# EAGLE board pic32mk (EAGLE 9.6.2), part 1 of 2
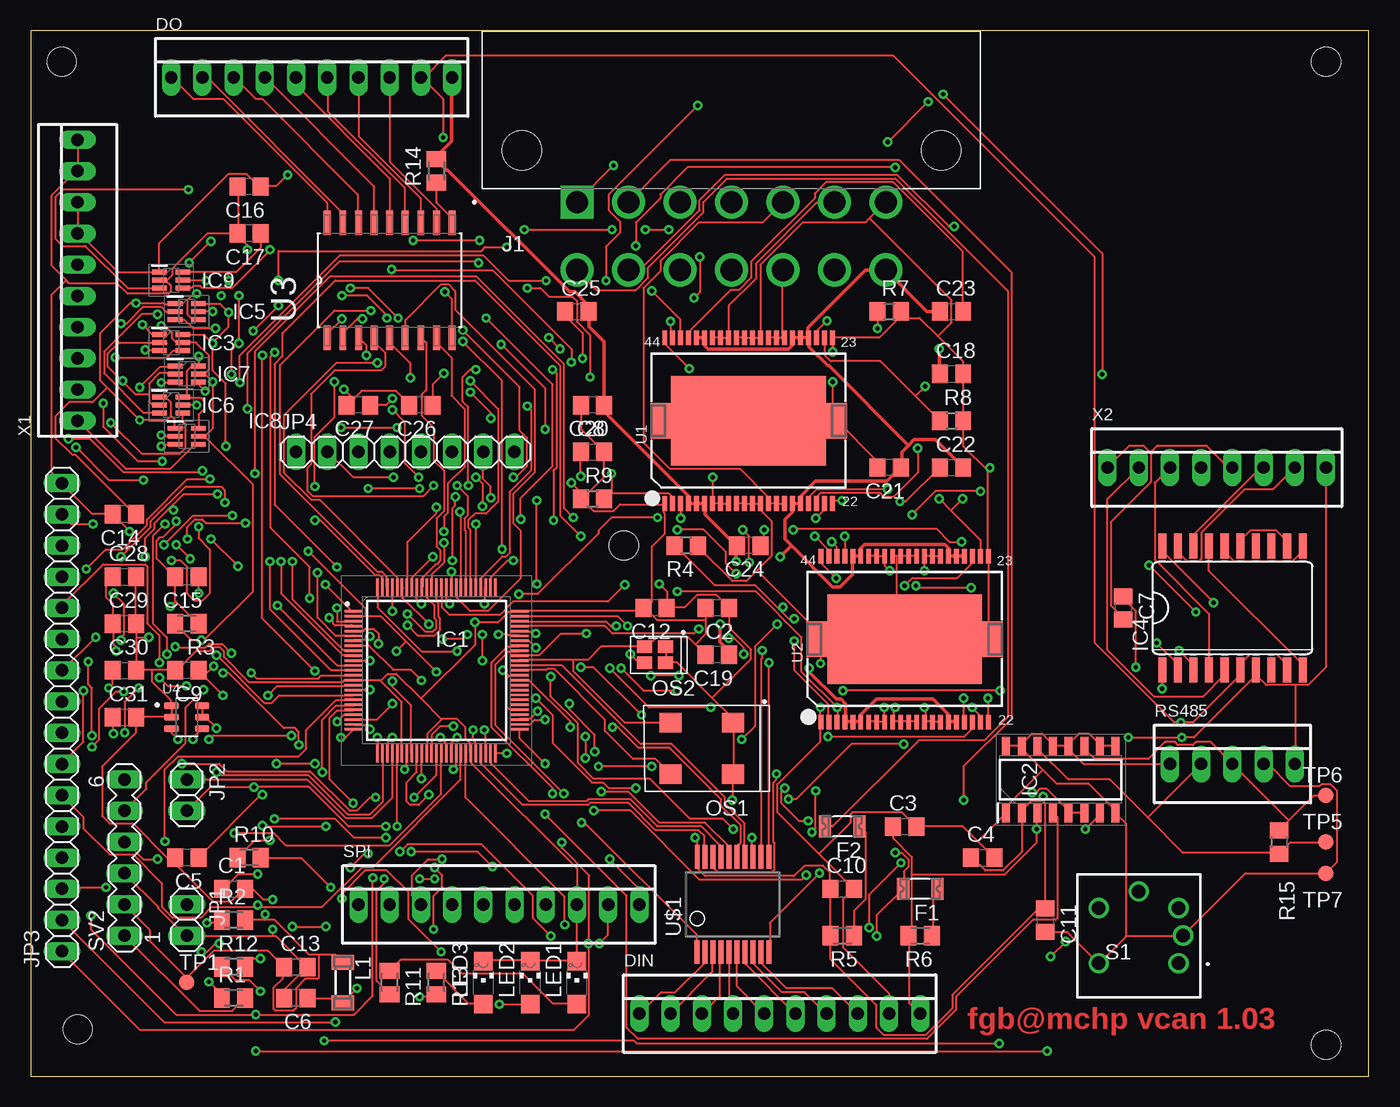
[diagram p1: board, top side]
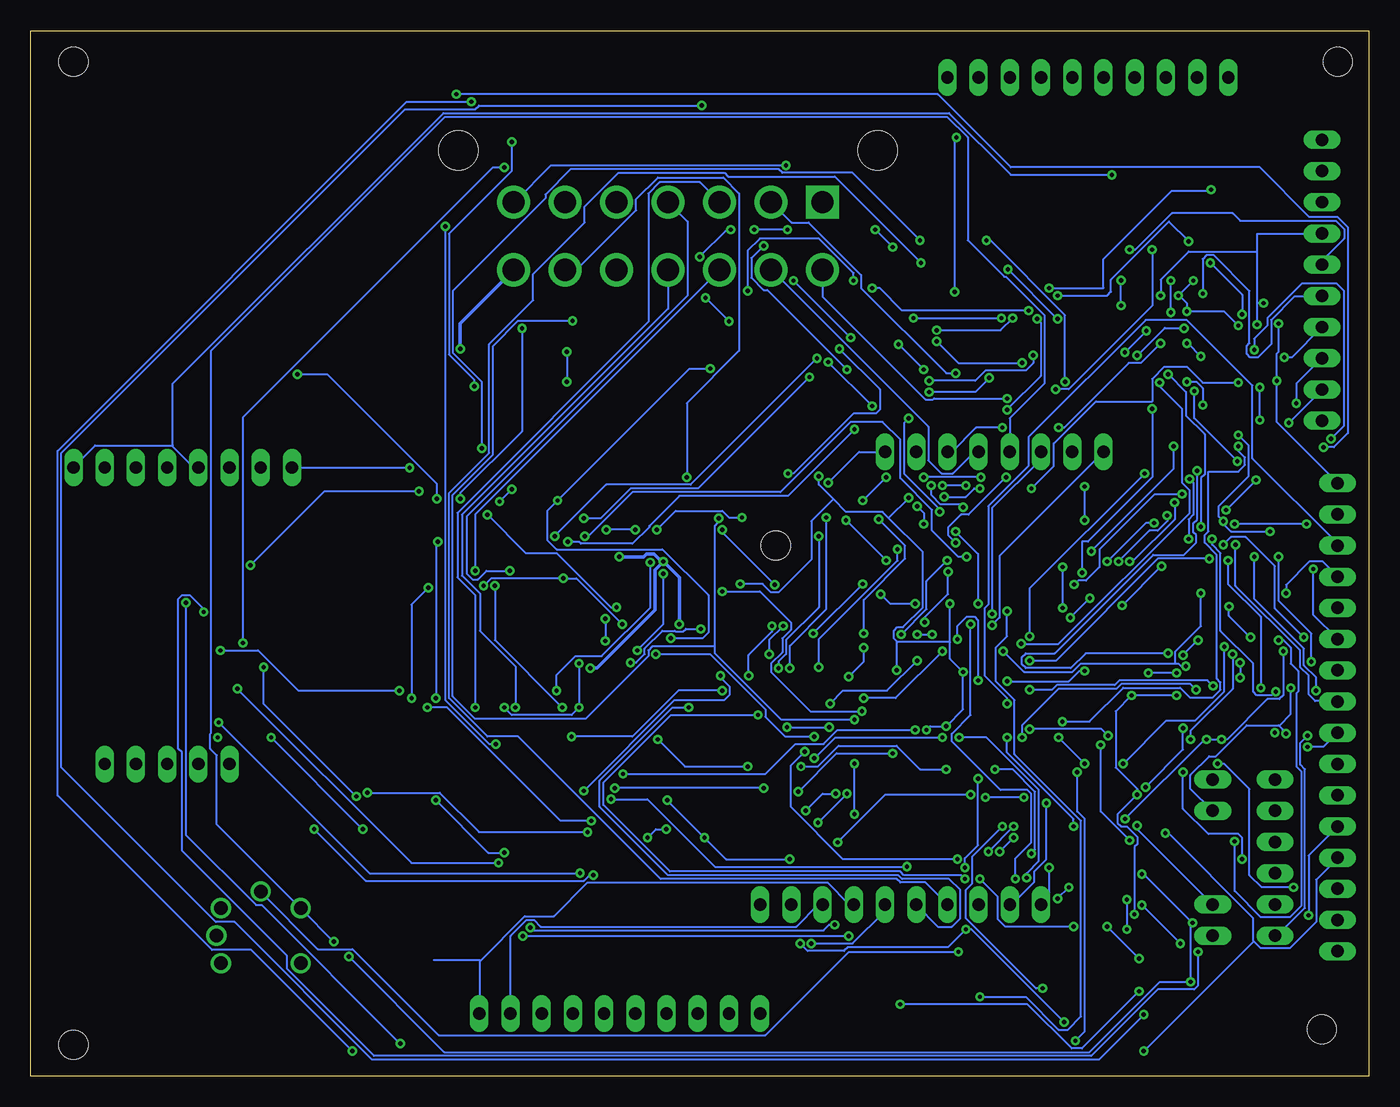
[diagram p2: board, bottom side, seen from below]

Size 108.89 x 85.08 mm. Coordinates in mm from the lower left corner, seen from the top.
Outline: 0,0 108.89,0 108.89,85.08 0,85.08 0,0
Copper layers (1*16): Top 0.035mm / dielectric 1.5mm / Bottom 0.035mm
Design rules "default *": minimum track width 6mil, minimum drill 0.35mm, track to track 6mil, track to pad 6mil, pad to pad 6mil, via to via 6mil, smd to smd 0mil, copper to edge 40mil, drill to drill 6mil, minimum pad ring 10mil, minimum via ring 8mil, stop-mask expansion 4mil, vias tented up to drill 0mil, thermal gap 10mil
Net classes: 0 default: width 0.127 mm, drill 0.127 mm, clearance 0.127 mm; 1 icurrent: width 0.178 mm; 2 mcurrent: width 0.305 mm
Holes 2.35 mm at 2.54,82.55 105.41,82.55 105.41,2.54 3.81,3.81 48.26,43.18

## Footprints (pad centres in the part's own frame; a part is rotated, then mirrored left to right if it is on the bottom)
C0805 = smd 1.3 x 1.5: 1 -0.95,0; 2 0.95,0
22-23-2101 = drill 1 long: 1 -11.43,0; 2 -8.89,0; 3 -6.35,0; 4 -3.81,0; 5 -1.27,0; 6 1.27,0; 7 3.81,0; 8 6.35,0; 9 8.89,0; 10 11.43,0
1206L = smd 1 x 1.8: 1 -1.4,0; 2 1.4,0
QFP40P1400X1400X120-100N = smd 1.475 x 0.2: 1 -6.738,4.8; 2 -6.738,4.4; 3 -6.738,4; 4 -6.738,3.6; 5 -6.738,3.2; 6 -6.738,2.8; 7 -6.738,2.4; 8 -6.738,2; 9 -6.738,1.6; 10 -6.738,1.2; 11 -6.738,0.8; 12 -6.738,0.4; 13 -6.738,0; 14 -6.738,-0.4; 15 -6.738,-0.8; 16 -6.738,-1.2; 17 -6.738,-1.6; 18 -6.738,-2; 19 -6.738,-2.4; 20 -6.738,-2.8; 21 -6.738,-3.2; 22 -6.738,-3.6; 23 -6.738,-4; 24 -6.738,-4.4; 25 -6.738,-4.8; 51 6.738,-4.8; 52 6.738,-4.4; 53 6.738,-4; 54 6.738,-3.6; 55 6.738,-3.2; 56 6.738,-2.8; 57 6.738,-2.4; 58 6.738,-2; 59 6.738,-1.6; 60 6.738,-1.2; 61 6.738,-0.8; 62 6.738,-0.4; 63 6.738,0; 64 6.738,0.4; 65 6.738,0.8; 66 6.738,1.2; 67 6.738,1.6; 68 6.738,2; 69 6.738,2.4; 70 6.738,2.8; 71 6.738,3.2; 72 6.738,3.6; 73 6.738,4; 74 6.738,4.4; 75 6.738,4.8 | smd 0.2 x 1.475: 26 -4.8,-6.738; 27 -4.4,-6.738; 28 -4,-6.738; 29 -3.6,-6.738; 30 -3.2,-6.738; 31 -2.8,-6.738; 32 -2.4,-6.738; 33 -2,-6.738; 34 -1.6,-6.738; 35 -1.2,-6.738; 36 -0.8,-6.738; 37 -0.4,-6.738; 38 0,-6.738; 39 0.4,-6.738; 40 0.8,-6.738; 41 1.2,-6.738; 42 1.6,-6.738; 43 2,-6.738; 44 2.4,-6.738; 45 2.8,-6.738; 46 3.2,-6.738; 47 3.6,-6.738; 48 4,-6.738; 49 4.4,-6.738; 50 4.8,-6.738; 76 4.8,6.738; 77 4.4,6.738; 78 4,6.738; 79 3.6,6.738; 80 3.2,6.738; 81 2.8,6.738; 82 2.4,6.738; 83 2,6.738; 84 1.6,6.738; 85 1.2,6.738; 86 0.8,6.738; 87 0.4,6.738; 88 0,6.738; 89 -0.4,6.738; 90 -0.8,6.738; 91 -1.2,6.738; 92 -1.6,6.738; 93 -2,6.738; 94 -2.4,6.738; 95 -2.8,6.738; 96 -3.2,6.738; 97 -3.6,6.738; 98 -4,6.738; 99 -4.4,6.738; 100 -4.8,6.738
SOIC127P600X175-16N = smd 1.525 x 0.65: 1 -2.712,4.445; 2 -2.712,3.175; 3 -2.712,1.905; 4 -2.712,0.635; 5 -2.712,-0.635; 6 -2.712,-1.905; 7 -2.712,-3.175; 8 -2.712,-4.445; 9 2.712,-4.445; 10 2.712,-3.175; 11 2.712,-1.905; 12 2.712,-0.635; 13 2.712,0.635; 14 2.712,1.905; 15 2.712,3.175; 16 2.712,4.445
SOT65P210X110-6N = smd 1.2 x 0.4: 1 -0.95,0.65; 2 -0.95,0; 3 -0.95,-0.65; 4 0.95,-0.65; 5 0.95,0; 6 0.95,0.65
SO20L = smd 0.66 x 2.032: 1 -5.715,-5.029; 2 -4.445,-5.029; 3 -3.175,-5.029; 4 -1.905,-5.029; 5 -0.635,-5.029; 6 0.635,-5.029; 7 1.905,-5.029; 8 3.175,-5.029; 9 4.445,-5.029; 10 5.715,-5.029; 11 5.715,5.029; 12 4.445,5.029; 13 3.175,5.029; 14 1.905,5.029; 15 0.635,5.029; 16 -0.635,5.029; 17 -1.905,5.029; 18 -3.175,5.029; 19 -4.445,5.029; 20 -5.715,5.029
TE_1-1586043-4 = drill 1.8 pad 2.15 square: 1 0,0 | drill 1.8 pad 2.15: 2 0,5.5; 3 -4.19,0; 4 -4.19,5.5; 5 -8.38,0; 6 -8.38,5.5; 7 -12.57,0; 8 -12.57,5.5; 9 -16.76,0; 10 -16.76,5.5; 11 -20.95,0; 12 -20.95,5.5; 13 -25.14,0; 14 -25.14,5.5 | hole 3.2: -29.64,-4.2; 4.5,-4.2
1X02 = drill 1.016 long: 1 -1.27,0; 2 1.27,0
1X16 = drill 1.016 long: 1 -19.05,0; 2 -16.51,0; 3 -13.97,0; 4 -11.43,0; 5 -8.89,0; 6 -6.35,0; 7 -3.81,0; 8 -1.27,0; 9 1.27,0; 10 3.81,0; 11 6.35,0; 12 8.89,0; 13 11.43,0; 14 13.97,0; 15 16.51,0; 16 19.05,0
1X08 = drill 1.016 long: 1 -8.89,0; 2 -6.35,0; 3 -3.81,0; 4 -1.27,0; 5 1.27,0; 6 3.81,0; 7 6.35,0; 8 8.89,0
SM-1206 = smd 1.2 x 1.8: 1 -1.65,0; 2 1.65,0
CHIPLED_1206 = smd 1.5 x 1.5: A 0,-1.75; C 0,1.75
7.2X5.2-4-PAD = smd 1.8 x 1.6: 1 -2.54,-2.1; 2 2.54,-2.1; 3 2.54,2.1; 4 -2.54,2.1
2.5X2-4-PAD = smd 1.2 x 1: 1 -0.85,-0.65; 2 0.85,-0.65; 3 0.85,0.65; 4 -0.85,0.65
M0805 = smd 1.3 x 1.6: 1 -0.95,0; 2 0.95,0
R0805 = smd 1.3 x 1.5: 1 -0.95,0; 2 0.95,0
22-23-2051 = drill 1 long: 1 -5.08,0; 2 -2.54,0; 3 0,0; 4 2.54,0; 5 5.08,0
B3W-9_1-LED = drill 1.1 pad 1.65: 1 3.25,-2.25; 2 -3.25,-2.25; 3 3.25,2.25; 4 -3.25,2.25; 5 0,3.6; 6 3.6,0
MA06-1 = drill 1.016 long: 1 -6.35,0; 2 -3.81,0; 3 -1.27,0; 4 1.27,0; 5 3.81,0; 6 6.35,0
B1,27 = smd 1.27 x 1.27: TP 0,0
SOP44-0.65-15.8X10.9MM = smd 0.4 x 1.2: 1 -6.825,-6.75; 2 -6.175,-6.75; 3 -5.525,-6.75; 4 -4.875,-6.75; 5 -4.225,-6.75; 6 -3.575,-6.75; 7 -2.925,-6.75; 8 -2.275,-6.75; 9 -1.625,-6.75; 10 -0.975,-6.75; 11 -0.325,-6.75; 12 0.325,-6.75; 13 0.975,-6.75; 14 1.625,-6.75; 15 2.275,-6.75; 16 2.925,-6.75; 17 3.575,-6.75; 18 4.225,-6.75; 19 4.875,-6.75; 20 5.525,-6.75; 21 6.175,-6.75; 22 6.825,-6.75; 23 6.825,6.75; 24 6.175,6.75; 25 5.525,6.75; 26 4.875,6.75; 27 4.225,6.75; 28 3.575,6.75; 29 2.925,6.75; 30 2.275,6.75; 31 1.625,6.75; 32 0.975,6.75; 33 0.325,6.75; 34 -0.325,6.75; 35 -0.975,6.75; 36 -1.625,6.75; 37 -2.275,6.75; 38 -2.925,6.75; 39 -3.575,6.75; 40 -4.225,6.75; 41 -4.875,6.75; 42 -5.525,6.75; 43 -6.175,6.75; 44 -6.825,6.75 | smd 12.6 x 7.3: EH@1 0,0 | smd 1.7 x 2.9: EH@2 -7.15,0; EH@3 7.15,0
SOIC127P1030X265-18N = smd 1.981 x 0.559: 1 -4.674,5.08; 2 -4.674,3.81; 3 -4.674,2.54; 4 -4.674,1.27; 5 -4.674,0; 6 -4.674,-1.27; 7 -4.674,-2.54; 8 -4.674,-3.81; 9 -4.674,-5.08; 10 4.674,-5.08; 11 4.674,-3.81; 12 4.674,-2.54; 13 4.674,-1.27; 14 4.674,0; 15 4.674,1.27; 16 4.674,2.54; 17 4.674,3.81; 18 4.674,5.08
SOT95P280X145-6N = smd 1.21 x 0.58: 1 -1.255,0.95; 2 -1.255,0; 3 -1.255,-0.95; 4 1.255,-0.95; 5 1.255,0; 6 1.255,0.95
SSOP20 = smd 0.381 x 1.93: CH_L 2.925,3.879; EN_L -2.925,-3.879; GND 2.925,-3.879; IN1 -2.275,-3.879; IN2 -1.625,-3.879; IN3 -0.975,-3.879; IN4 -0.325,-3.879; IN5 0.325,-3.879; IN6 0.975,-3.879; IN7 1.625,-3.879; IN8 2.275,-3.879; OUT1 -2.275,3.879; OUT2 -1.625,3.879; OUT3 -0.975,3.879; OUT4 -0.325,3.879; OUT5 0.325,3.879; OUT6 0.975,3.879; OUT7 1.625,3.879; OUT8 2.275,3.879; VCC -2.917,3.868
22-23-2081 = drill 1 long: 1 -8.89,0; 2 -6.35,0; 3 -3.81,0; 4 -1.27,0; 5 1.27,0; 6 3.81,0; 7 6.35,0; 8 8.89,0

## Placement (x,y rotation side)
C1  0.1  [C0805]  16.51,15.24 0 top
C2  0.1  [C0805]  55.88,38.1 180 top
C3  0.1  [C0805]  71.12,20.32 0 top
C4  0.1  [C0805]  77.47,17.78 0 top
C5  0.1  [C0805]  12.7,17.78 180 top
C6  0.1  [C0805]  21.59,6.35 180 top
C7  22uf  [C0805]  88.9,38.1 270 top
C8  0.1  [C0805]  45.72,50.8 0 top
C9  0.1  [C0805]  12.7,33.02 180 top
C10  0.1  [C0805]  66.04,15.24 0 top
C11  22uf  [C0805]  82.55,12.7 270 top
C12  0.1  [C0805]  50.8,38.1 180 top
C13  0.1  [C0805]  21.59,8.89 0 top
C14  0.1  [C0805]  7.62,45.72 180 top
C15  0.1  [C0805]  12.7,40.64 180 top
C16  0.1  [C0805]  17.78,72.39 180 top
C17  0.1  [C0805]  17.78,68.58 180 top
C18  0.1  [C0805]  74.93,57.15 0 top
C19  0.1  [C0805]  55.88,34.29 180 top
C20  0.1  [C0805]  45.72,54.61 180 top
C21  0.1  [C0805]  69.85,49.53 180 top
C22  0.1  [C0805]  74.93,49.53 0 top
C23  0.1  [C0805]  74.93,62.23 0 top
C24  0.1  [C0805]  58.42,43.18 180 top
C25  0.1  [C0805]  44.45,62.23 0 top
C26  22uf  [C0805]  31.75,54.61 180 top
C27  22uf  [C0805]  26.67,54.61 180 top
C28  22uf  [C0805]  7.62,40.64 0 top
C29  0.1  [C0805]  7.62,36.83 0 top
C30  22uf  [C0805]  7.62,33.02 0 top
C31  0.1  [C0805]  7.62,29.21 0 top
DIN  22-23-2101  [22-23-2101]  60.96,5.08 0 top
DO  22-23-2101  [22-23-2101]  22.86,81.28 0 top
F1  1206L050  [1206L]  72.39,15.24 180 top
F2  1206L050  [1206L]  66.04,20.32 180 top
IC1  PIC32MK1024MCF100-I_PT  [QFP40P1400X1400X120-100N]  33.02,33.02 0 top
IC2  ADM3095EBRZ  [SOIC127P600X175-16N]  83.82,24.13 90 top
IC3  TXB0101DCKR  [SOT65P210X110-6N]  11.43,59.69 0 top
IC4  MAX203ECWP  [SO20L]  97.79,38.1 0 top
IC5  TXB0101DCKR  [SOT65P210X110-6N]  12.7,62.23 0 top
IC6  TXB0101DCKR  [SOT65P210X110-6N]  11.43,54.61 0 top
IC7  TXB0101DCKR  [SOT65P210X110-6N]  12.7,57.15 0 top
IC8  TXB0101DCKR  [SOT65P210X110-6N]  12.7,52.07 0 top
IC9  TXB0101DCKR  [SOT65P210X110-6N]  11.43,64.77 0 top
J1  1-1586043-4  [TE_1-1586043-4]  44.45,71.12 180 top
JP1  vref-  [1X02]  12.7,12.7 270 top
JP2  vref+  [1X02]  12.7,22.86 270 top
JP3  io pins  [1X16]  2.54,29.21 90 top
JP4  IO_volts  [1X08]  30.48,50.8 0 top
L1  1000  [SM-1206]  25.4,7.62 270 top
LED1  led1  [CHIPLED_1206]  44.45,7.62 0 top
LED2  led2  [CHIPLED_1206]  40.64,7.62 0 top
LED3  led3  [CHIPLED_1206]  36.83,7.62 0 top
OS1  OSC-OE-CFPS-32  [7.2X5.2-4-PAD]  54.61,26.67 180 top
OS2  OSC-OE-IQXO-793  [2.5X2-4-PAD]  50.8,34.29 180 top
R1  1k  [M0805]  16.51,6.35 0 top
R2  10k  [M0805]  16.51,12.7 0 top
R3  1k  [M0805]  12.7,36.83 0 top
R4  100  [R0805]  53.34,43.18 180 top
R5  0  [M0805]  66.04,11.43 180 top
R6  0  [M0805]  72.39,11.43 180 top
R7  100  [R0805]  69.85,62.23 0 top
R8  100  [R0805]  74.93,53.34 0 top
R9  100  [R0805]  45.72,46.99 0 top
R10  1k  [M0805]  17.78,17.78 0 top
R11  1k  [M0805]  29.21,7.62 270 top
R12  1k  [M0805]  16.51,8.89 0 top
R13  1k  [M0805]  33.02,7.62 270 top
R14  0  [M0805]  33.02,73.66 90 top
R15  120  [R0805]  101.6,19.05 270 top
RS485  22-23-2051  [22-23-2051]  97.79,25.4 0 top
S1  B3W-9000-Y1N  [B3W-9_1-LED]  90.17,11.43 0 top
SPI  22-23-2101  [22-23-2101]  38.1,13.97 0 top
SV2  ICSP2  [MA06-1]  7.62,17.78 90 top
TP1  TPB1,27  [B1,27]  12.7,7.62 0 top
TP5  TPB1,27  [B1,27]  105.41,19.05 0 top
TP6  TPB1,27  [B1,27]  105.41,22.86 0 top
TP7  TPB1,27  [B1,27]  105.41,16.51 0 top
U1  PMIC-MC33932VW(SOP44)  [SOP44-0.65-15.8X10.9MM]  58.42,53.34 0 top
U2  PMIC-MC33932VW(SOP44)  [SOP44-0.65-15.8X10.9MM]  71.12,35.56 0 top
U3  ULN2803ADW  [SOIC127P1030X265-18N]  29.21,64.77 90 top
U4  REF3440IDBVR  [SOT95P280X145-6N]  12.7,29.21 0 top
U$1  MAX6818  [SSOP20]  57.15,13.97 0 top
X1  22-23-2101  [22-23-2101]  3.81,64.77 90 top
X2  22-23-2081  [22-23-2081]  96.52,49.53 0 top

## Tracks (layer width: path | path; a pad name or v marks a point on that pad's centre or on a via)
+3V3  (via drill 0.35)
  Top 0.152: C27.1 28.9,54.61 v29.44,55.14 | F2.2 65.25,20.32 72.26,27.33 77.6,27.33 79.5,29.23 79.5,63.91 70.36,73.05 56.64,73.05 54.74,71.14 54.74,70.31 50.24,65.81 50.24,64.97 49.25,63.98 46.05,63.98 44.45,65.58 J1.2
  Bottom 0.152: v29.44,55.14 35.38,55.14 35.46,55.07 36.07,55.07 44.45,63.45 J1.2
+5V  (via drill 0.35)
  Top 0.152: v11.99,27.41 11.45,27.94 11.45,28.24 U4.3 | v13.21,27.41 13.21,27.56 13.89,28.24 U4.4 | C28.1 6.66,40.59 6.12,40.06 6.12,38.99 6.66,38.46 6.66,36.85 C29.1 6.73,36.78 6.73,35.18 6.96,34.95 v6.96,34.57 | v33.63,57.2 32.72,56.29 32.72,54.61 C26.1 | v70.36,18.19 70.89,18.19 71.43,17.65 71.43,17.04 71.04,16.66 71.04,15.29 F1.2 70.97,15.21 68.83,13.08 v68.83,11.41 | v75.92,22.45 75.92,25.2 79.81,29.08 79.81,65.43 70.66,74.57 52.07,74.57 48.64,71.14 J1.3 | v19.84,20.93 24.79,20.93 26.31,19.41 v28.9,19.41 | v30.05,18.26 30.66,18.87 36.68,18.87 40.87,14.68 40.87,12.85 v42.32,11.41
  Bottom 0.152: v6.96,34.57 6.96,30.99 7.26,30.68 8.25,30.68 11.53,27.41 v11.99,27.41 v13.21,27.41 13.36,27.41 v19.84,20.93 | v33.63,57.2 34.39,57.2 41.33,64.14 41.33,65.2 45.59,69.47 46.96,69.47 48.56,71.07 J1.3 | v70.36,18.19 71.65,18.19 v75.92,22.45 | v30.05,18.26 v28.9,19.41 | v68.83,11.41 v42.32,11.41
+24V  (via drill 0.35)
  Top 0.305: U2.26 75.92,42.34 75.46,42.34 U2.27 75.31,42.34 74.7,42.34 U2.28 74.7,42.49 74.7,42.95 74.4,43.26 67.84,43.26 67.54,42.95 67.54,42.49 U2.39 67.54,42.34 66.93,42.34 U2.40 66.85,42.19 66.85,40.82 65.86,39.83 65.25,39.83 61.9,43.18 | 71.43,51.33 70.89,50.8 70.89,49.66 C21.1 70.74,49.5 69.67,48.44 63.88,48.44 62.59,47.14 62.59,46.76 U1.18 62.59,46.61 62.05,46.61 U1.17 61.98,46.46 61.98,45.92 61.37,45.31 61.37,43.71 61.9,43.18 | 71.43,51.33 71.88,51.79 73.64,51.79 75.84,49.58 C22.2 | U1.40 54.81,60.1 U1.39 54.89,59.94 54.89,59.41 55.12,59.18 61.67,59.18 61.98,59.49 61.98,59.94 U1.28 62.05,60.1 62.59,60.1 U1.27 62.74,60.1 63.27,60.1 U1.26 | v73.94,59.18 73.94,57.2 C18.1 | C23.1 72.95,62.23 69.6,65.58 J1.14 69.44,65.58 67.92,65.58 63.27,60.93 63.27,60.25 U1.26 | 71.43,51.33 64.95,57.81 64.87,57.81 63.35,59.33 63.35,59.94 U1.26 | DO.10 34.24,81.28 34.24,76.1 33.02,74.88 R14.2 33.1,74.5 33.86,73.74 33.93,73.74 43.84,63.83 44.3,63.83 45.29,62.84 45.29,62.31 C25.2 45.44,62.23 45.44,61.01 46.66,59.79 C20.1 46.74,54.53 46.74,54 53.59,47.14 53.59,46.76 U1.4 53.59,46.61 54.13,46.61 U1.5 54.36,46.61 54.81,46.61 U1.6 54.89,46.46 54.89,45.7 57.33,43.26 C24.2 57.4,43.18 v57.4,41.88 | U2.18 75.31,28.85 74.7,28.85 U2.17 74.7,29.01 74.7,29.39 73.41,30.68 68.83,30.68 67.54,29.39 67.54,29.01 U2.6 67.54,28.85 67.01,28.85 U2.5 66.85,28.85 66.32,28.85 U2.4 66.32,29.01 66.32,30.3 65.94,30.68 65.56,30.68 63.35,32.89 v63.35,33.2 | v56.11,36.78 56.11,35.33 56.79,34.65 56.79,34.34 C19.1 | v60.98,42.27 61.9,43.18
  Bottom 0.305: v73.94,59.18 73.94,61.24 69.6,65.58 J1.14 | v56.11,36.78 56.11,40.59 v57.4,41.88 | v63.35,33.2 62.81,33.2 58.09,37.92 58.09,41.2 v57.4,41.88 | v60.98,42.27 59,42.27 58.78,42.49 58.17,42.49 57.56,41.88 v57.4,41.88
DERE  (via drill 0.35)
  Top 0.152: v48.56,36.63 47.8,37.39 39.8,37.39 IC1.74 | v52.76,32.59 v50.47,32.59 | v63.88,23.22 63.88,20.17 v63.58,19.86 | v81.48,23.06 81.79,23.06 82.09,23.37 82.7,23.37 84.46,21.62 84.46,21.46 | 84.46,21.46 85.67,21.46 IC2.6 | 84.46,21.46 IC2.5
  Bottom 0.152: v48.56,36.63 48.56,36.17 50.47,34.27 v50.47,32.59 | v52.76,32.59 52.76,32.44 51.99,31.67 51.99,31.06 52.45,30.61 56.49,30.61 v63.88,23.22 | v63.58,19.86 72.42,19.86 75.62,23.06 v81.48,23.06
GND  (via drill 0.35)
  Top 0.152: v33.71,63.83 34.24,63.3 34.24,60.1 U3.9 | v33.55,76.4 33.55,79.53 31.8,81.28 DO.9 31.95,81.2 33.78,83.03 70.21,83.03 86.59,66.65 86.59,35.26 93.07,28.78 v93.6,28.78 94.59,28.78 98.4,32.59 98.4,33.05 IC4.6 98.48,33.12 98.48,33.58 99.24,34.34 101.37,34.34 102.21,33.5 102.21,33.12 IC4.9 | v64.19,16.51 60.15,12.47 60.15,10.11 U$1.GND
  Bottom 0.152: v33.71,63.83 33.71,76.25 v33.55,76.4 | v64.19,16.51 81.33,16.51 v93.6,28.78
IN1
  Top 0.152: IC1.47 36.6,26.26 36.6,25.5 40.03,22.07 45.36,22.07 45.52,22.23 48.64,22.23 50.85,20.02 54.36,20.02 54.81,19.56 54.81,17.88 U$1.OUT1
IN2  (via drill 0.35)
  Top 0.152: v36.91,28.17 36.98,28.09 36.98,26.34 IC1.48 | v60.68,24.59 60.68,24.13 60.45,23.9 60.45,19.02 60.53,18.95 60.53,16.81 60.3,16.59 55.96,16.59 55.57,16.97 55.57,17.8 U$1.OUT2
  Bottom 0.152: v36.91,28.17 43.23,28.17 44.37,27.03 46.66,27.03 49.1,24.59 v60.68,24.59
IN3
  Top 0.152: IC1.49 37.44,26.26 37.44,25.5 40.56,22.38 45.21,22.38 45.36,22.53 48.79,22.53 51,20.32 54.59,20.32 56.11,18.8 56.11,17.88 U$1.OUT3
IN4  (via drill 0.35)
  Top 0.152: v38.73,26.26 37.82,26.26 IC1.50 | v46.43,23.14 48.64,23.14 51.16,20.62 54.89,20.62 56.79,18.72 56.79,17.88 U$1.OUT4
  Bottom 0.152: v38.73,26.26 43.31,26.26 v46.43,23.14
IN5  (via drill 0.35)
  Top 0.152: v43.92,28.4 43.92,28.85 40.56,32.21 39.8,32.21 IC1.61 | v47.35,28.4 47.8,28.4 49.48,26.72 51.99,26.72 56.19,22.53 56.19,22 57.78,20.4 57.78,19.02 57.48,18.72 57.48,17.88 U$1.OUT5
  Bottom 0.152: v47.35,28.4 v43.92,28.4
IN6
  Top 0.152: IC1.64 39.8,33.43 43.23,33.43 49.63,27.03 52.15,27.03 56.49,22.68 56.49,22.15 58.09,20.55 58.09,17.88 U$1.OUT6
IN7  (via drill 0.35)
  Top 0.152: v41.1,34.87 40.56,35.41 39.8,35.41 IC1.69 | v42.32,32.51 42.32,30.91 44.53,28.7 44.53,25.5 45.82,24.21 50.39,24.21 53.67,20.93 56.34,20.93 v57.17,20.09 | v58.7,19.41 58.7,17.88 U$1.OUT7
  Bottom 0.152: v41.1,34.87 41.1,33.73 v42.32,32.51 | v57.17,20.09 58.01,20.09 v58.7,19.41
IN8  (via drill 0.35)
  Top 0.152: v48.34,39.98 46.96,38.61 39.27,38.61 38.2,37.54 34.09,37.54 33.48,38.15 33.48,39.75 IC1.87 | v52.6,44.48 54.74,44.48 56.57,42.65 56.57,41.73 v57.4,40.89 | v59.54,34.65 59.54,34.04 59.46,33.96 59.46,17.88 U$1.OUT8
  Bottom 0.152: v48.34,39.98 52.6,44.25 v52.6,44.48 | v57.4,40.89 57.4,36.78 v59.54,34.65
MCLEAR  (via drill 0.35)
  Top 0.152: v18.47,16.43 16.87,16.43 15.72,15.29 15.57,15.29 C1.1 | v14.35,12.47 15.27,12.47 15.49,12.7 R2.1 | v14.5,7.67 15.49,6.68 15.49,6.38 R1.1 | v84.23,10.95 v83.01,9.73
  Bottom 0.152: v18.47,16.43 18.31,16.43 v14.35,12.47 14.5,12.55 v14.5,7.67 17.02,7.67 22.73,1.96 75.23,1.96 v83.01,9.73 | JP4.4 29.21,53.54 26.39,56.36 26.39,61.92 29.52,65.05 29.67,65.05 32.64,68.02 32.64,76.4 34.31,78.08 75.16,78.08 94.21,59.03 94.21,27.94 94.29,27.86 94.29,26.65 93.75,26.11 93.75,20.47 86.97,13.69 S1.4 86.89,13.61 v84.23,10.95
N$2  (via drill 0.35)
  Top 0.152: v19.46,41.88 19.46,38 24.41,33.05 26.24,33.05 IC1.13 | v15.8,46.68 15.8,47.68 15.49,47.98 12.6,47.98 9.78,45.16 9.78,44.7 v7.34,42.27 | v4.67,33.73 4.67,31.9 4.98,31.6 v4.98,27.71 | SV2.1 13.74,5.31 16.41,5.31 17.4,6.3 R1.2
  Bottom 0.152: v19.46,41.88 19.23,41.88 15.8,45.31 v15.8,46.68 | v7.34,42.27 7.34,38.68 4.67,36.02 v4.67,33.73 | v4.98,27.71 5.59,27.1 5.59,25.35 5.21,24.97 5.21,13.69 7.42,11.48 7.57,11.48 SV2.1
N$3
  Top 0.152: R5.1 67.01,11.48 67.01,13.46 67.92,14.38 67.92,19.86 67.46,20.32 F2.1
N$4
  Top 0.152: U$1.IN1 54.81,10.03 54.81,9.2 52.45,6.83 51.31,6.83 49.55,5.08 DIN.1
N$5  (via drill 0.35)
  Top 0.152: 12.45,59.03 IC3.4 11.61,59.03 11.07,58.5 v6.88,58.5
  Bottom 0.152: v6.88,58.5 6.27,58.5 X1.4
N$6  (via drill 0.35)
  Top 0.152: v29.82,20.32 29.82,26.26 IC1.30 | v26.54,7.14 25.4,5.99 L1.2 25.4,6.07 25.17,6.3 22.58,6.3 C6.1
  Bottom 0.152: v29.82,20.32 32.26,17.88 32.26,15.67 32.79,15.14 32.79,12.85 27.08,7.14 v26.54,7.14
N$7
  Top 0.152: IC1.63 39.8,33.05 41.94,33.05 42.01,33.12 42.62,33.12 46.74,29.01 46.74,28.09 49.02,25.81 50.85,25.81 52.07,24.59 OS1.3
N$8  (via drill 0.35)
  Top 0.152: v13.51,63.68 13.28,63.68 12.75,63.14 12.75,62 13.13,61.62 13.59,61.62 IC5.4
  Bottom 0.152: v13.51,63.68 13.51,66.5 13.21,66.8 12.6,66.8 9.7,63.91 9.7,59.64 9.93,59.41 9.93,58.8 9.63,58.5 9.02,58.5 7.95,59.56 7.95,61.54 6.04,63.45 3.83,63.45 X1.5
N$9
  Top 0.152: R6.1 73.41,11.48 73.41,14.83 73.79,15.21 F1.1
N$10
  Top 0.152: 13.59,51.41 IC8.4 13.51,51.41 13.36,51.41 11.38,49.43 7.72,49.43 X1.1
N$11  (via drill 0.35)
  Top 0.152: 12.37,53.92 IC6.4 12.37,53.85 12.37,53.24 12.6,53.01 12.6,51.1 12.14,50.65 9.02,50.65 v6.5,53.16
  Bottom 0.152: v6.5,53.16 3.83,55.83 X1.2
N$12  (via drill 0.35)
  Top 0.152: v14.2,55.75 13.66,56.29 13.66,56.44 IC7.4 | v10.69,50.04 8.71,50.04 5.89,52.86 v5.89,54.76
  Bottom 0.152: v14.2,55.75 14.2,53.54 v10.69,50.04 | v5.89,54.76 5.89,56.36 3.83,58.42 X1.3
N$13  (via drill 0.35)
  Top 0.152: v15.11,24.74 15.34,24.51 22.58,24.51 25.78,21.31 27.61,21.31 28.68,22.38 28.68,26.26 IC1.27 | v10.31,17.65 9.17,17.65 7.8,19.02 7.65,19.02 SV2.4
  Bottom 0.152: v15.11,24.74 15.11,21.77 13.06,19.71 10.62,19.71 10.31,19.41 v10.31,17.65
N$14  (via drill 0.35)
  Top 0.152: v28.22,27.56 28.22,26.34 IC1.26 | v14.05,31.45 12.6,30 12.6,27.1 9.4,23.9 9.4,23.37 SV2.5
  Bottom 0.152: v28.22,27.56 28.22,28.55 25.25,31.52 20.52,31.52 20.14,31.9 14.5,31.9 v14.05,31.45
N$15  (via drill 0.35)
  Top 0.152: 12.45,64.14 IC9.4 12.52,64.14 13.06,64.14 13.21,64.29 13.82,64.29 13.97,64.14 16.41,64.14 19.46,67.18 v19.46,67.26
  Bottom 0.152: v19.46,67.26 19,67.26 16.03,70.23 11.07,70.23 10.46,69.62 2.69,69.62 2.01,68.94 2.01,68.17 3.76,66.42 3.76,66.04 X1.6
N$16  (via drill 0.35)
  Top 0.152: v48.79,34.34 49.48,33.66 49.94,33.66 OS2.3 | v47.65,36.63 47.19,36.63 46.81,37.01 39.8,37.01 IC1.73
  Bottom 0.152: v48.79,34.34 48.79,35.48 v47.65,36.63
N$17
  Top 0.152: DIN.2 55.5,8.51 55.5,10.03 U$1.IN2
N$18
  Top 0.152: U$1.IN3 56.11,10.03 56.11,6.53 54.66,5.08 DIN.3
N$19
  Top 0.152: U$1.IN4 56.87,10.03 56.87,5.31 57.1,5.08 DIN.4
N$20
  Top 0.152: DIN.5 57.48,7.29 57.48,10.03 U$1.IN5
N$21
  Top 0.152: U$1.IN6 58.17,10.03 58.17,9.12 62.2,5.08 DIN.6
N$22
  Top 0.152: U$1.IN7 58.78,10.03 58.78,9.2 61.14,6.83 62.97,6.83 64.72,5.08 DIN.7
N$23
  Top 0.152: DIN.8 65.25,7.14 61.52,7.14 59.46,9.2 59.46,10.03 U$1.IN8
N$24  (via drill 0.35)
  Top 0.152: v69.75,47.75 63.96,47.75 63.35,47.14 63.35,46.61 U1.19 | v70.74,46.76 71.2,46.76 73.94,49.5 C22.1
  Bottom 0.152: v70.74,46.76 v69.75,47.75
N$25
  Top 0.152: U1.41 53.59,60.1 53.59,60.63 56.95,63.98 57.63,63.98 58.62,64.97 58.62,66.27 63.8,71.45 63.8,71.83 64.72,72.75 70.21,72.75 75.84,67.11 75.84,62.23 C23.2
N$26  (via drill 0.35)
  Top 0.152: v75.92,30.76 75.92,28.85 U2.19 | v75.77,43.48 74.78,43.48 73.71,44.55 62.13,44.55 v62.05,44.48 | v59.69,44.48 59.69,43.48 59.38,43.18 C24.1
  Bottom 0.152: v75.92,30.76 75.92,43.33 v75.77,43.48 | v59.69,44.48 v62.05,44.48
N$27  (via drill 0.35)
  Top 0.152: v66.24,43.94 66.24,42.34 U2.41 | v44.91,58.42 44.91,60.48 43.54,61.85 43.54,62.23 C25.1
  Bottom 0.152: v66.24,43.94 62.05,48.13 55.19,48.13 v44.91,58.42
N$32  (via drill 0.35)
  Top 0.152: v24.41,15.37 22.05,17.73 18.77,17.73 R10.2 | v25.32,14.45 25.32,14.83 27.23,16.74 28.98,16.74 30.73,14.99 30.73,12.78 v33.4,10.11
  Bottom 0.152: v25.32,14.45 v24.41,15.37 | v33.4,10.11 42.32,10.11 49.1,3.33 75.69,3.33 82.7,10.34 85.52,10.34 90.17,14.99 S1.5
N$33  (via drill 0.35)
  Top 0.152: v32.41,36.78 30.28,38.91 30.28,39.75 IC1.95 | v28.75,16.05 28.75,15.67 28.14,15.06 28.14,7.75 R11.2
  Bottom 0.152: v32.41,36.78 32.41,29.39 33.93,27.86 33.93,27.25 29.97,23.29 27.76,23.29 27.46,22.99 27.46,19.02 28.75,17.73 v28.75,16.05
N$34  (via drill 0.35)
  Top 0.152: v28.22,58.04 24.87,58.04 20.6,53.77 20.6,49.12 22.81,46.91 23.49,46.91 29.82,40.59 29.82,39.83 IC1.96 | v35.15,59.79 38.35,56.59 v38.35,42.88 | v44.76,33.27 45.82,33.27 v49.71,29.39 | v31.65,16.05 v32.87,16.05 | v21.29,12.17 v24.03,12.17 | v18.69,9.58 18.16,9.58 17.48,8.89 R12.2
  Bottom 0.152: v28.22,58.04 33.4,58.04 v35.15,59.79 | v38.35,42.88 38.35,41.96 44.76,35.56 v44.76,33.27 | v49.71,29.39 56.79,29.39 62.28,23.9 62.28,22.07 56.87,16.66 38.12,16.66 37.82,16.36 33.17,16.36 v32.87,16.05 | v31.65,16.05 30.2,14.61 30.2,12.78 29.59,12.17 v24.03,12.17 | v18.69,9.58 v21.29,12.17
N$35  (via drill 0.35)
  Top 0.152: v29.44,37.85 29.44,39.75 IC1.97 | v31.65,6.45 32.87,6.45 33.02,6.6 R13.2
  Bottom 0.152: v29.44,37.85 29.44,35.79 30.35,34.87 30.35,32.13 28.83,30.61 28.83,26.19 23.42,20.78 23.42,4.85 24.49,3.79 25.25,3.79 27.91,6.45 v31.65,6.45
N$36
  Top 0.152: LED1.A 44.45,5.92 42.47,5.92 40.03,8.36 35.08,8.36 33.93,9.5 30.12,9.5 29.21,8.59 R11.1
N$37  (via drill 0.35)
  Top 0.152: v38.12,5.84 40.64,5.84 LED2.A | v18.69,6.91 17.78,7.82 16.64,7.82 R12.1
  Bottom 0.152: v38.12,5.84 27.76,5.84 24.18,2.26 23.34,2.26 v18.69,6.91
N$38
  Top 0.152: LED3.A 36.83,5.92 35.61,5.92 33.02,8.51 R13.1
N$39
  Top 0.152: 90.89,21.04 93.75,18.19 101.6,18.19 R15.2 102.51,19.02 105.41,19.02 TP5.TP 105.41,19.1 | 90.89,21.04 87.81,24.13 84.46,24.13 81.94,26.65 81.94,26.8 IC2.14 | 90.89,21.04 RS485.2
N$40
  Top 0.152: 102.4,20.81 101.6,20.02 R15.1 | 102.4,20.81 104.42,22.84 105.41,22.84 TP6.TP | 85.75,26.65 85.75,26.8 IC2.11 85.75,26.65 | 85.75,26.65 86.59,25.81 90.93,25.81 92.3,27.18 93.14,27.18 93.37,26.95 94.59,26.95 94.82,27.18 96.04,27.18 97.79,25.42 | 97.79,25.42 102.4,20.81 | 97.79,25.42 RS485.3
N$41
  Top 0.152: IC4.17 95.89,41.12 103.51,33.5 IC4.10
N$42
  Top 0.152: IC4.11 103.51,42.72 102.67,41.88 97.94,41.88 97.18,42.65 97.18,43.1 IC4.16
N$43
  Top 0.152: IC4.15 98.48,43.18 98.48,43.64 99.24,44.4 101.37,44.4 102.21,43.56 102.21,43.18 IC4.12
N$44
  Top 0.152: IC4.5 97.1,33.05 97.1,32.59 95.43,30.91 91.39,30.91 87.58,34.72 87.58,46.91 90.17,49.5 X2.2
N$45
  Top 0.152: IC4.4 95.89,37.62 91.47,42.04 91.47,48.28 X2.3
N$46
  Top 0.152: U3.18 24.11,69.47 24.11,71.07 15.65,79.53 13.21,79.53 11.45,81.28 DO.1
N$47
  Top 0.152: U3.17 25.4,70.23 14.35,81.28 DO.2
N$48
  Top 0.152: U3.16 26.62,69.47 26.62,71.75 18.85,79.53 18.31,79.53 16.56,81.28 DO.3
N$49
  Top 0.152: U3.15 27.91,69.47 27.91,72.44 19.07,81.28 DO.4
N$50
  Top 0.152: U3.14 29.21,73.05 21.59,80.67 DO.5
N$51
  Top 0.152: U3.13 30.43,69.47 30.43,72.29 24.18,78.54 24.18,81.28 DO.6
N$52
  Top 0.152: U3.12 31.72,69.47 31.72,71.45 26.7,76.48 26.7,81.28 DO.7
N$53
  Top 0.152: U3.11 33.02,70.61 29.21,74.42 DO.8
N$54
  Top 0.152: R14.1 33.02,71.07 34.24,69.85 34.24,69.47 U3.10
N$55
  Top 0.152: IC4.18 94.67,43.18 94.67,44.09 100.08,49.5 100.31,49.5 X2.6
N$56
  Top 0.152: IC4.19 93.37,43.1 93.37,42.65 94.13,41.88 95.05,41.88 95.28,42.11 95.28,44.25 98.78,47.75 101.07,47.75 102.82,49.5 X2.7
N$57  (via drill 0.35)
  Top 0.152: v29.44,27.56 29.06,27.18 29.06,26.34 IC1.28 | v24.03,20.32 18.92,20.32 v18.85,20.4
  Bottom 0.152: v29.44,27.56 29.44,26.34 24.03,20.93 v24.03,20.32 | v18.85,20.4 18.85,20.09 12.75,13.99 JP1.1
N$58
  Top 0.152: JP2.1 22.5,24.13 25.63,21.01 27.76,21.01 29.44,22.68 29.44,26.26 IC1.29
PWM1H  (via drill 0.35)
  Top 0.152: v52.07,61.44 52.07,60.32 52.23,60.17 U1.43 | v53.98,63.34 54.45,63.82 v54.45,66.67 | v50.01,68.9 v51.91,68.9 | v40.16,68.9 v47.31,68.9 | v38.73,67.47 36.99,67.47 36.67,67.15 20.16,67.15 v20.16,64.77 | v18.1,60.64 v20.16,62.71 | v19.84,58.9 19.53,58.58 19.53,44.61 22.7,41.43 v22.7,38.89 | v24.29,37.31 24.61,36.99 24.61,36.83 24.77,36.67 26.19,36.67 IC1.4
  Bottom 0.152: v53.98,63.34 v52.07,61.44 | v54.45,66.67 52.23,68.9 v51.91,68.9 | v47.31,68.9 v50.01,68.9 | v38.73,67.47 v40.16,68.9 | v20.16,62.71 v20.16,64.77 | v19.84,58.9 v18.1,60.64 | v24.29,37.31 v22.7,38.89
PWM1L  (via drill 0.35)
  Top 0.152: v50.55,63.91 52.83,61.62 52.83,60.1 U1.42 | v41.94,64.75 38.89,64.75 36.83,66.8 25.17,66.8 17.02,58.65 v17.02,56.44 | v28.3,35.18 28.3,36.02 27.91,36.4 27.23,36.4 27.08,36.25 26.31,36.25 IC1.5
  Bottom 0.152: v50.55,63.91 50.55,67.18 49.55,68.17 44.76,68.17 41.94,65.35 v41.94,64.75 | v17.02,56.44 17.02,56.13 15.19,54.3 15.19,48.28 14.58,47.68 14.58,45.85 25.25,35.18 v28.3,35.18
PWM2H  (via drill 0.35)
  Top 0.152: v63.88,45.39 64.57,46.08 64.57,46.53 U1.21 | v45.52,56.9 45.52,60.32 44.45,61.39 44.45,63.07 44.07,63.45 42.16,63.45 41.48,64.14 v40.41,64.14 | v27.69,62.31 24.71,62.31 20.29,57.89 20.29,48.97 28.22,41.05 28.6,41.05 28.98,40.66 28.98,39.83 IC1.98
  Bottom 0.152: v63.88,45.39 62.51,45.39 60.07,47.83 54.59,47.83 v45.52,56.9 | v40.41,64.14 39.8,64.14 37.97,62.31 v27.69,62.31
PWM2L  (via drill 0.35)
  Top 0.152: v72.19,51.1 72.19,49.12 70.21,47.14 69.44,47.14 69.14,47.45 64.26,47.45 63.96,47.14 63.96,46.61 U1.20 | v31.11,68.02 v36.52,68.02 | v24.71,56.52 24.71,53.62 23.11,52.02 v23.11,47.98 | v23.11,45.24 23.57,45.24 28.07,40.74 28.45,40.74 28.6,40.59 28.6,39.83 IC1.99
  Bottom 0.152: v72.19,51.1 72.19,56.52 74.55,58.88 74.55,63.91 67.01,71.45 67.01,71.75 64.95,73.81 48.03,73.81 47.73,73.51 42.01,73.51 v36.52,68.02 | v31.11,68.02 30.81,68.02 24.71,61.92 v24.71,56.52 | v23.11,45.24 v23.11,47.98
PWM3H  (via drill 0.35)
  Top 0.152: v63.8,43.94 64.87,42.88 64.87,42.34 U2.43 | v32.72,42.27 31.04,40.59 31.04,39.83 IC1.93
  Bottom 0.152: v63.8,43.94 63.5,43.94 59.92,47.52 47.88,47.52 42.16,53.24 39.57,53.24 38.12,51.79 38.12,48.67 35.53,46.08 35.53,44.4 33.4,42.27 v32.72,42.27
PWM3L  (via drill 0.35)
  Top 0.152: v65.18,43.48 65.56,43.1 65.56,42.34 U2.42 | v41.86,52.63 41.86,55.98 v38.28,59.56 | v36.22,57.51 35.76,57.51 35.15,56.9 35.15,54.91 35.61,54.46 v35.61,48.06 | v33.02,46.3 33.02,45.85 30.66,43.48 30.66,39.83 IC1.94
  Bottom 0.152: v65.18,43.48 64.26,43.48 64.11,43.33 59.92,43.33 58.55,44.7 58.55,44.78 56.11,47.22 47.27,47.22 v41.86,52.63 | v36.22,57.51 v38.28,59.56 | v35.61,48.06 35.61,47.3 34.85,46.53 33.25,46.53 v33.02,46.3
PWM4H  (via drill 0.35)
  Top 0.152: v76.61,30 77.29,29.31 77.29,28.85 U2.21 | v63.27,20.78 62.51,20.78 61.06,22.23 61.06,23.14 v61.37,23.44 | v49.25,23.44 47.04,23.44 46.58,23.9 45.67,23.9 42.47,27.1 42.47,29.39 v41.1,30.76 | v34.7,34.57 31.8,34.57 28.22,38.15 IC1.100
  Bottom 0.152: v76.61,30 75.01,30 65.79,20.78 v63.27,20.78 | v49.25,23.44 v61.37,23.44 | v41.1,30.76 38.51,30.76 v34.7,34.57
PWM4L  (via drill 0.35)
  Top 0.152: v64.87,27.63 76,27.63 76.61,28.24 76.61,28.78 U2.20 | v52.6,31.37 49.86,31.37 v48.03,33.2 | v44.76,43.94 43.08,45.62 43.08,57.81 36.14,64.75 24.79,64.75 20.5,60.46 20.48,60.48 20.48,58.58 19.84,57.94 19.84,46.51 v24.92,41.43 | 25.48,37.01 26.24,37.01 IC1.3 25.56,36.99 24.92,36.99 v24.92,38.1
  Bottom 0.152: v64.87,27.63 59.92,27.63 56.19,31.37 v52.6,31.37 | v48.03,33.2 48.03,33.73 47.42,34.34 47.42,35.48 44.76,38.15 v44.76,43.94 | v24.92,41.43 v24.92,38.1
RA1  (via drill 0.35)
  Top 0.152: v29.44,30.3 28.14,29.01 26.31,29.01 IC1.23
  Bottom 0.152: v29.44,30.3 29.44,30.76 31.27,32.59 31.27,38.07 30.96,38.38 30.96,46.38 27.69,49.66 27.69,52.02 18.16,61.54 14.81,61.54 9.47,56.21 9.47,50.27 2.54,43.33 JP3.14
RB0  (via drill 0.35)
  Top 0.152: v27.61,28.24 27.3,28.55 26.31,28.55 IC1.24 | v21.21,27.71 14.81,27.71 v14.5,27.41 | v11.07,34.34 11.07,35.71 9.93,36.85 9.93,43.94 v10.92,44.93 | v5.05,44.93 3.3,44.93 2.54,45.7 JP3.15
  Bottom 0.152: v27.61,28.24 21.74,28.24 v21.21,27.71 | v14.5,27.41 14.5,28.09 11.07,31.52 v11.07,34.34 | v5.05,44.93 v10.92,44.93
RC2  (via drill 0.35)
  Top 0.152: v32.41,22.91 31.57,22.07 30.89,22.07 30.58,22.38 30.58,23.9 31.42,24.74 31.42,26.26 IC1.34 | v43.23,19.02 43.23,18.57 45.44,16.36 45.44,10.79 | 45.44,10.79 45.44,5 44.22,3.79 8.87,3.79 2.54,10.11 JP3.1 | 45.44,10.79 v45.36,10.79
  Bottom 0.152: v32.41,22.91 39.34,22.91 v43.23,19.02 | v45.36,10.79 42.01,10.79 39.42,13.39 39.42,13.92 SPI.6
RC8  (via drill 0.35)
  Top 0.152: v35.76,56.59 38.05,54.3 38.05,46.76 37.06,45.77 36.14,45.77 35.61,45.24 35.61,44.63 35.76,44.48 35.76,39.83 IC1.81 | v27.3,58.65 27.3,59.49 26.7,60.1 U3.3
  Bottom 0.152: v35.76,56.59 32.03,56.59 31.19,57.43 27.91,57.43 27.3,58.04 v27.3,58.65
RC9
  Top 0.152: IC1.84 34.62,38.99 35.76,37.85 37.21,37.85 39.88,40.51 39.88,44.4 39.27,45.01 39.27,47.37 41.02,49.12 41.02,55.91 34.54,62.38 34.54,63.91 34.01,64.44 33.4,64.44 30.5,61.54 30.5,60.1 U3.6
RC11  (via drill 0.35)
  Top 0.152: v31.8,24.21 31.8,26.26 IC1.35 | v32.87,16.97 33.48,16.36 33.48,15.37 32.79,14.68 v32.79,11.94 | v24.79,4.39 10.85,4.39 JP3.2 | v46.28,10.79 46.96,11.48 46.96,13.92 SPI.9
  Bottom 0.152: v31.8,24.21 31.8,18.8 32.87,17.73 v32.87,16.97 | v24.79,4.39 32.33,11.94 v32.79,11.94 34.24,10.49 42.39,10.49 42.7,10.19 45.67,10.19 v46.28,10.79
RD4  (via drill 0.35)
  Top 0.152: v21.29,41.88 21.29,38.84 25.48,34.65 26.24,34.65 IC1.9 | v17.48,45.01 14.27,45.01 13.97,45.31 13.36,45.31 12.75,44.7 v12.75,43.71 | v7.57,31.29 6.96,31.29 5.59,29.92 5.59,27.41 v4.98,26.8
  Bottom 0.152: v21.29,41.88 18.16,45.01 v17.48,45.01 | v12.75,43.71 12.75,43.26 12.07,42.57 12.07,36.25 9.4,33.58 9.4,31.29 9.09,30.99 7.87,30.99 v7.57,31.29 | v4.98,26.8 3.68,26.8 JP3.8
RD5  (via drill 0.35)
  Top 0.152: v34.7,48.06 35.53,47.22 35.53,45.62 35.31,45.39 35.31,44.48 35.38,44.4 35.38,39.83 IC1.82 | v32.79,48.06 31.95,47.22 22.96,47.22 22.5,47.68 22.5,49.5 22.81,49.81 22.81,55.52 24.71,57.43 28.52,57.43 28.83,57.73 28.83,58.88 27.99,59.71 27.99,60.1 U3.4
  Bottom 0.152: v32.79,48.06 v34.7,48.06
RD6  (via drill 0.35)
  Top 0.152: v34.92,45.92 35,45.85 35,39.83 IC1.83 | v37.44,53.54 37.44,54 v35.76,55.68 | v30.89,56.82 30.89,58.04 29.21,59.71 U3.5
  Bottom 0.152: v34.92,45.92 34.92,46.15 37.82,49.05 37.82,53.16 v37.44,53.54 | v35.76,55.68 32.03,55.68 v30.89,56.82
RD8  (via drill 0.35)
  Top 0.152: v42.47,22.99 42.47,23.44 37.52,28.4 37.52,33.66 38.81,34.95 39.73,34.95 IC1.68 | v44.83,20.62 45.06,20.62 54.2,11.48 54.2,10.11 U$1.EN_L
  Bottom 0.152: v44.83,20.62 v42.47,22.99
RD12  (via drill 0.35)
  Top 0.152: v40.41,54.53 40.72,54.23 40.72,49.28 38.96,47.52 38.96,42.57 38.66,42.27 38.35,42.27 36.6,40.51 36.6,39.83 IC1.79 | v43.99,58.11 43.99,59.18 37.59,65.58 29.44,65.58 v29.36,65.66 | v25.32,61.62 24.18,60.48 24.18,60.1 U3.1
  Bottom 0.152: v43.99,58.11 v40.41,54.53 | v25.32,61.62 v29.36,65.66
RD13  (via drill 0.35)
  Top 0.152: v36.22,44.93 36.22,39.83 IC1.80 | v36.75,46.38 36.75,48.21 v36.22,48.74 | v31.57,48.74 30.43,49.89 30.43,53.24 v29.44,54.23 | v27,61.62 26.54,61.62 25.4,60.48 U3.2
  Bottom 0.152: v36.22,44.93 36.22,45.85 v36.75,46.38 | v31.57,48.74 v36.22,48.74 | v29.44,54.23 26.7,56.97 26.7,61.32 v27,61.62
RE8  (via drill 0.35)
  Top 0.152: 14.24,52.13 14.2,52.09 13.66,52.09 IC8.5 | 11.84,59.71 12.37,59.71 IC3.5 | 13.13,62.23 IC5.5 v14.81,62.23 | 13.66,57.2 IC7.5 | 12.45,59.71 IC3.5 | v14.27,64.75 12.45,64.75 IC9.5 | v15.11,34.27 19,30.38 19.61,30.38 20.22,30.99 26.24,30.99 IC1.18 | R3.1 11.76,36.78 13.06,35.48 v13.89,35.48 14.12,35.48 18.09,39.45 18.09,48.13 14.27,51.94 14.27,52.09 14.24,52.13 | v13.51,54.61 IC6.5 | IC7.5 13.74,57.2 14.12,57.2 v14.81,56.52 14.81,52.7 14.24,52.13 | IC3.5 12.52,59.71 13.44,59.71 14.5,58.65 14.5,57.51 14.2,57.2 IC7.5 | v10.62,61.09 10.92,61.09 11.53,60.48 11.53,60.02 11.84,59.71 | 11.84,59.71 IC3.5
  Bottom 0.152: v14.27,64.75 v15.49,63.52 15.42,63.52 14.81,62.92 v14.81,62.23 11.76,62.23 v10.62,61.09 | v13.89,35.48 v15.11,34.27 | v13.51,54.61 13.51,55.98 14.05,56.52 v14.81,56.52
RE9  (via drill 0.35)
  Top 0.152: v10.92,19.1 10.92,24.97 11.99,26.03 21.82,26.03 22.43,26.65 22.43,28.17 24.87,30.61 26.24,30.61 IC1.19 | v7.34,35.48 7.34,35.71 7.57,35.94 7.57,38.46 v6.73,39.29
  Bottom 0.152: v10.92,19.1 10.92,15.06 8.79,12.93 6.43,12.93 5.51,13.84 5.51,24.82 5.89,25.2 5.89,31.14 5.74,31.29 5.74,32.97 6.35,33.58 6.35,34.87 6.96,35.48 v7.34,35.48 | v6.73,39.29 6.73,39.98 4.83,41.88 3.76,41.88 2.54,40.66 JP3.13
RE14  (via drill 0.35)
  Top 0.152: 18.47,13.77 14.73,13.77 13.89,12.93 11.53,12.93 10.67,13.79 10.67,15.7 8.33,18.03 6.43,18.03 4.29,20.17 4.29,21.08 2.54,22.84 JP3.6 | 18.47,13.77 23.72,13.77 27,17.04 27.91,17.04 35,24.13 35,26.26 IC1.43 | v62.13,35.41 62.13,33.05 64.87,30.3 64.87,28.85 U2.2 | v62.13,37.24 61.67,37.24 60.95,37.96 | 60.95,37.96 58.93,39.98 55.65,39.98 52.45,43.18 R4.2 | 60.95,37.96 61.14,38.15 v61.21,38.15 | v71.73,45.7 73.64,47.6 v77.29,47.6 | v94.82,37.77 v91.01,41.58 | v13.89,10.11 14.35,10.11 15.04,10.79 v15.34,10.79 | 18.47,13.77 v18.47,13.92
  Bottom 0.152: v62.13,37.24 v62.13,35.41 | v61.21,38.15 61.67,38.15 66.09,42.57 68.61,42.57 v71.73,45.7 | v77.29,47.6 84.99,47.6 v91.01,41.58 | v94.82,37.77 94.82,38 95.96,39.14 96.57,39.14 96.88,38.84 96.88,26.65 96.57,26.34 96.57,18.34 88.04,9.8 88.04,8.74 80.95,1.65 22.58,1.65 17.17,7.06 14.2,7.06 13.89,7.37 v13.89,10.11 | v18.47,13.92 v15.34,10.79
REFOUT  (via drill 0.35)
  Top 0.152: U4.6 13.97,30.15 13.97,29.23 U4.5 14.05,29.23 14.2,29.23 v15.11,28.32 | v6.73,27.86 6.73,29.16 C31.1 | v6.35,31.6 6.66,31.9 6.66,32.97 C30.1 | JP2.2 12.75,21.62 14.66,23.52 v18.16,23.52 22.66,23.52 25.86,20.32 v28.9,20.32 | v30.96,18.26 36.37,18.26 v37.59,17.04 | v61.67,22.53 62.28,22.53 66.78,27.03 v71.04,27.03 | v75.16,69.16 74.7,69.16 70.51,73.36 56.49,73.36 54.43,71.3 54.43,70.46 49.63,65.66 48.64,65.66 J1.4
  Bottom 0.152: v6.73,27.86 7.04,28.17 7.04,28.24 7.3,28.51 | 7.3,28.51 7.34,28.55 9.93,28.55 12.45,26.03 12.98,26.03 14.5,24.51 14.5,23.37 12.75,21.62 JP2.2 | v6.35,31.6 6.35,29.46 7.3,28.51 | v15.11,28.32 15.11,26.57 v18.16,23.52 | JP4.5 32.11,50.8 33.86,49.05 34.77,49.05 35.84,50.11 35.84,52.86 48.56,65.58 J1.4 | v30.96,18.26 v28.9,20.32 | v37.59,17.04 53.21,17.04 58.7,22.53 v61.67,22.53 | v71.04,27.03 71.58,27.03 75.16,30.61 v75.16,69.16
RF1  (via drill 0.35)
  Top 0.152: IC1.88 33.02,38.61 33.17,38.46 33.17,37.39 33.33,37.24 33.33,36.32 32.87,35.87 31.5,35.87 v30.66,36.7
  Bottom 0.152: v30.66,36.7 30.05,37.31 30.05,42.34 JP4.1
RF6
  Top 0.152: IC1.91 31.88,39.83 31.88,40.59 32.94,41.66 33.02,41.66 33.33,41.96 33.33,42.8 33.02,43.1 33.02,45.39 33.63,46 33.63,49.28 32.79,50.11 32.79,52.78 31.8,53.77 31.8,55.45 32.18,55.83 32.18,59.71 31.8,60.1 U3.7
RF7  (via drill 0.35)
  Top 0.152: v31.8,38.46 31.42,38.84 IC1.92 | v33.63,44.32 33.63,45.54 33.93,45.85 33.93,48.21 35.31,49.58 35.31,54.3 34.24,55.37 34.24,58.5 33.02,59.71 U3.8
  Bottom 0.152: v31.8,38.46 31.8,42.49 v33.63,44.32
RF12  (via drill 0.35)
  Top 0.152: v33.33,27.56 33.78,27.1 33.78,26.34 IC1.40 | v27.84,16.13 27.84,6.53 26.31,5 v18.31,5 11.84,5 4.9,11.94 v4.9,13.08 | 47.27,47.45 47.19,47.45 46.74,46.99 R9.2 47.27,47.45 | 47.27,47.45 51.92,47.45 52.22,47.14 52.22,46.61 U1.2 | v47.27,49.05 47.27,47.45 | v42.16,60.1 v43.08,59.18 | v46.81,64.75 46.81,67.49 47.95,68.63 47.95,69.55 47.04,70.46 47.04,71.75 v54.28,78.99
  Bottom 0.152: v33.33,27.56 31.11,27.56 26.85,23.29 26.85,17.5 27.84,16.51 v27.84,16.13 | v4.9,13.08 4.9,17.96 JP3.5 | v47.27,49.05 46.81,49.05 41.94,53.92 40.11,53.92 39.8,54.23 39.8,55.91 v43.08,59.18 | v46.81,64.75 v42.16,60.1 | v54.28,78.99 72.42,78.99 72.72,78.69 78.44,78.69 106.4,50.72 106.4,25.12 93.83,12.55 92.3,12.55 81.1,1.35 21.97,1.35 v18.31,5
RF13  (via drill 0.35)
  Top 0.152: v16.56,19.79 19.76,19.79 20.75,18.8 29.21,18.8 33.4,22.99 33.4,26.26 IC1.39 | 72,55.33 73.94,53.39 R8.1 | 72,55.33 69.14,58.19 65.1,58.19 64.64,58.65 64.64,60.02 U1.24 | v72.8,56.13 72,55.33 | v73.03,79.3 v69.75,76.02 | v18.31,2.03 v82.7,2.03
  Bottom 0.152: v16.56,19.79 16.33,19.79 9.4,12.85 9.4,11.02 9.36,10.98 | 9.36,10.98 8.79,10.41 6.43,10.41 4.29,12.55 4.29,15.98 2.54,17.73 JP3.4 | v72.8,56.13 72.8,56.67 74.85,58.73 74.85,68.56 69.75,73.66 v69.75,76.02 | v73.03,79.3 78.28,79.3 106.71,50.88 106.71,22.84 94.13,10.26 90.93,10.26 v82.7,2.03 | 9.36,10.98 v18.31,2.03
RG0  (via drill 0.35)
  Top 0.152: v30.66,37.62 32.11,36.17 32.72,36.17 33.02,36.47 33.02,37.08 32.87,37.24 32.87,38.3 32.26,38.91 32.26,39.75 IC1.90
  Bottom 0.152: v30.66,37.62 30.66,46.23 26.7,50.19 26.7,50.8 JP4.3
RG1  (via drill 0.35)
  Top 0.152: v33.63,43.41 33.63,41.81 32.64,40.82 32.64,39.83 IC1.89 | v29.52,48.74 26.24,48.74 24.18,50.8 JP4.2
  Bottom 0.152: v33.63,43.41 34.24,44.02 34.24,44.63 33.17,45.7 32.56,45.7 v29.52,48.74
RG6  (via drill 0.35)
  Top 0.152: v20.37,41.88 20.37,39.29 25.4,34.27 26.24,34.27 IC1.10 | v16.41,45.62 13.21,45.62 v10.85,43.26
  Bottom 0.152: v20.37,41.88 17.86,44.4 17.17,44.4 16.41,45.16 v16.41,45.62 | v10.85,43.26 10.85,39.9 5.59,34.65 5.59,33.27 4.9,32.59 4.9,31.06 4.37,30.53 2.54,30.53 JP3.9
RG7  (via drill 0.35)
  Top 0.152: v27.61,33.81 26.31,33.81 IC1.11 | v11.84,43.26 v12.98,42.11 | v5.28,35.71 2.54,32.97 JP3.10
  Bottom 0.152: v27.61,33.81 25.48,33.81 17.17,42.11 v12.98,42.11 | v11.84,43.26 11.23,43.87 10.01,43.87 7.65,41.5 7.65,38.07 v5.28,35.71
RG8  (via drill 0.35)
  Top 0.152: v20.07,38.3 24.94,33.43 26.24,33.43 IC1.12 | v14.66,43.71 v16.87,41.5 | v14.58,48.59 12.75,48.59 9.47,45.31 9.47,44.86 7.49,42.88 6.12,42.88 v4.52,41.27
  Bottom 0.152: v16.87,41.5 v20.07,38.3 | v14.66,43.71 14.66,45.31 14.27,45.7 14.27,48.28 v14.58,48.59 | v4.52,41.27 4.52,37.54 JP3.11
RG10  (via drill 0.35)
  Top 0.152: v27.61,31.45 26.31,31.45 IC1.17 | v12.68,31.75 11.15,31.75 v10.46,32.44 | v10.46,33.66 10.46,35.87 9.47,36.85 9.47,41.5 9.32,41.66 5.89,41.66 2.54,38.3 JP3.12
  Bottom 0.152: v27.61,31.45 25.78,31.45 25.4,31.83 20.68,31.83 20.29,32.21 13.13,32.21 v12.68,31.75 | v10.46,33.66 v10.46,32.44
RG11  (via drill 0.35)
  Top 0.152: IC1.38 33.02,24.51 v31.19,22.68 | v28.07,22.68 27.61,22.68 26.54,21.62 25.93,21.62 22.73,24.82 15.95,24.82 15.34,25.42 v12.29,25.42 | v6.12,15.37 2.62,15.37 2.54,15.29 JP3.3
  Bottom 0.152: v28.07,22.68 v31.19,22.68 | v12.29,25.42 11.76,25.42 9.7,23.37 9.7,16.36 8.71,15.37 v6.12,15.37
RG15  (via drill 0.35)
  Top 0.152: v15.19,47.37 12.45,47.37 11.34,46.27 | 11.34,46.27 10.08,45.01 10.08,44.55 9.32,43.79 v9.32,42.27 | v4.29,31.37 4.29,27.18 2.54,25.42 JP3.7 | 26.24,37.85 IC1.1 26.16,37.82 v23.97,40 | v73.94,46.99 74.89,46.04 | 74.89,46.04 77.29,43.64 77.29,42.34 U2.24 | v68.91,60.86 R7.1 | v75.84,46.99 74.89,46.04 | v87.2,57.12 87.2,66.95 v74.24,79.91 | 11.34,46.27 11.53,46.08 v11.61,46.08 | v9.17,48.51 6.35,48.51 v3.68,51.18
  Bottom 0.152: v9.32,42.27 9.32,38.84 5.28,34.8 5.28,33.43 4.29,32.44 v4.29,31.37 | v23.97,40 23.65,40.32 23.02,40.32 21.91,41.43 21.91,42.86 17.4,47.37 v15.19,47.37 | v73.94,46.99 73.94,47.45 68.91,52.48 v68.91,60.86 | v75.84,46.99 75.84,48.21 84.76,57.12 v87.2,57.12 | v74.24,79.91 35.08,79.91 29.13,73.97 8.87,73.97 4.83,69.93 2.54,69.93 1.7,69.09 1.7,52.32 2.85,51.18 v3.68,51.18 | v9.17,48.51 v11.61,46.08
RPA0  (via drill 0.35)
  Top 0.152: v24.94,28.85 25.48,29.39 26.24,29.39 IC1.22 | 11.68,51.41 IC8.3 11.61,51.41 10.77,51.41 v10.62,51.26
  Bottom 0.152: v24.94,28.85 22.73,28.85 19.99,31.6 15.34,31.6 14.58,30.84 12.68,30.84 12.07,31.45 12.07,32.05 12.37,32.36 12.37,42.42 13.36,43.41 13.36,44.02 13.06,44.32 13.06,49.2 10.62,49.2 10.08,49.73 10.08,50.34 10.62,50.88 v10.62,51.26
RPA14  (via drill 0.35)
  Top 0.152: v25.32,63.52 27.38,63.52 28.98,61.92 v28.98,61.7 | v35.15,60.71 39.8,56.06 39.8,52.55 40.41,51.94 40.41,49.66 39.5,48.74 v39.27,48.74 | v41.17,40.06 v41.17,46.84 | v45.21,36.02 43.16,36.02 41.4,34.27 39.8,34.27 IC1.66 | 10.46,54 IC6.3 10.39,54 9.17,54 5.97,57.2 5.97,58.95 9.02,62 v10.31,62 | v14.66,67.95 v12.9,66.19
  Bottom 0.152: v25.32,63.52 21.29,63.52 20.98,63.83 20.98,64.82 16.26,69.55 v14.66,67.95 | v28.98,61.7 29.97,60.71 v35.15,60.71 | v41.17,46.84 v39.27,48.74 | v45.21,36.02 v41.17,40.06 | v10.31,62 10.31,63.6 v12.9,66.19
RPB1  (via drill 0.35)
  Top 0.152: v16.33,34.42 15.57,35.18 14.5,35.18 14.2,34.87 11.84,34.87 v11.76,34.95 | v23.11,25.42 v19.99,25.42 | v25.25,27.56 25.63,27.56 26.24,28.17 IC1.25 | 10.46,59.11 IC3.3 10.39,59.11 v9.32,59.11 | v3.07,51.87 4.83,51.87 7.57,49.12 13.82,49.12 v13.97,49.28
  Bottom 0.152: v13.97,49.28 13.97,45.31 14.27,45.01 14.27,44.25 14.05,44.02 14.05,43.41 15.04,42.42 17.55,42.42 25.55,34.42 27.91,34.42 28.22,34.11 28.22,33.5 27.91,33.2 24.26,33.2 23.04,34.42 v16.33,34.42 | v11.76,34.95 11.76,31.29 14.12,28.93 16.48,28.93 v19.99,25.42 | v25.25,27.56 v23.11,25.42 | v9.32,59.11 9.32,60.02 8.25,61.09 8.25,61.7 5.44,64.52 2.62,64.52 2.01,63.91 2.01,52.93 v3.07,51.87
RPB6  (via drill 0.35)
  Top 0.152: v31.65,47.83 v27.46,47.83 | v34.54,47.14 34.54,46.46 34.31,46.23 v34.31,41.96 | v38.05,35.94 38.81,35.94 38.89,35.87 39.73,35.87 IC1.70 | 11.53,56.44 11.68,56.44 IC7.3 11.53,56.44 | v10.62,56.44 11.53,56.44
  Bottom 0.152: v27.46,47.83 25.63,49.66 25.63,51.49 22.2,54.91 17.63,54.91 17.63,56.74 16.64,57.73 14.81,57.73 13.51,56.44 v10.62,56.44 | v31.65,47.83 32.11,47.83 32.79,47.14 v34.54,47.14 | v34.31,41.96 35.99,40.28 35.99,38 v38.05,35.94
RPB7  (via drill 0.35)
  Top 0.152: v54.36,36.4 53.98,36.02 47.35,36.02 46.74,36.63 39.8,36.63 IC1.72 | v60.07,33.66 60.07,17.88 U$1.CH_L
  Bottom 0.152: v54.36,36.4 55.57,36.4 55.8,36.17 56.41,36.17 56.49,36.25 57.48,36.25 58.93,34.8 58.93,34.34 59.61,33.66 v60.07,33.66
RPC1  (via drill 0.35)
  Top 0.152: v18.85,58.65 18.85,37.24 v23.11,32.97 | v29.44,32.13 29.44,31.67 30.96,30.15 30.96,26.34 IC1.33 | 11.68,61.54 IC5.3 11.76,61.54 12.52,61.54 13.21,60.86 v15.04,60.86
  Bottom 0.152: v18.85,58.65 16.6,60.9 16.56,60.86 v15.04,60.86 | v23.11,32.97 23.57,32.97 24.41,32.13 v29.44,32.13
RPC10  (via drill 0.35)
  Top 0.152: v26.01,64.14 27.46,64.14 v29.9,61.7 | v37.06,61.7 42.47,56.29 42.47,49.66 39.88,47.07 v39.88,45.31 | v41.1,36.02 40.79,36.02 40.64,36.17 39.8,36.17 IC1.71 | v12.83,72.14 2.62,72.14 2.01,71.53 2.01,68.17 2.62,67.56 4.45,67.56 7.87,64.14 10.46,64.14 IC9.3
  Bottom 0.152: v26.01,64.14 21.59,64.14 21.59,66.5 16.03,72.06 12.9,72.06 v12.83,72.14 | v37.06,61.7 v29.9,61.7 | v39.88,45.31 37.74,43.18 37.74,42.11 41.1,38.76 v41.1,36.02
RPE0  (via drill 0.35)
  Top 0.152: v52.91,45.39 52.91,46.53 U1.3 | v41.86,29.01 41.02,29.01 40.64,28.63 39.8,28.63 IC1.52 | v64.8,61.47 63.96,60.63 U1.25
  Bottom 0.152: v52.91,45.39 52.91,45.09 53.21,44.78 53.21,34.95 | 53.21,34.95 53.21,34.42 47.8,29.01 v41.86,29.01 | v64.8,61.47 69.22,61.47 71.27,59.41 71.27,50.57 74.55,47.3 74.55,30.91 72.72,29.08 63.73,29.08 58.62,34.19 58.62,34.65 58.32,34.95 53.21,34.95
RPE1  (via drill 0.35)
  Top 0.152: v71.12,39.9 71.73,40.51 75.39,40.51 76.61,41.73 76.61,42.27 U2.25 | U2.3 65.63,28.85 v65.63,30 62.74,32.89 62.74,35.71 59,39.45 v52.6,39.45 | v41.25,29.69 40.64,29.08 39.8,29.08 IC1.53
  Bottom 0.152: v65.63,30 71.12,35.48 v71.12,39.9 | v41.25,29.69 45.44,29.69 48.64,32.89 48.64,33.58 47.73,34.49 47.73,35.64 47.04,36.32 47.04,36.93 49.55,39.45 v52.6,39.45
RPG9  (via drill 0.35)
  Top 0.152: v17.93,32.82 18.39,32.36 23.42,32.36 23.65,32.59 26.24,32.59 IC1.14 | v15.65,32.82 16.1,32.82 20.6,28.32 21.51,28.32 21.82,28.02 v21.82,26.95 | v19.46,19.18 18.24,19.18 16.87,17.8 R10.1
  Bottom 0.152: v15.65,32.82 v17.93,32.82 | v21.82,26.95 21.82,21.54 v19.46,19.18
SCK3  (via drill 0.35)
  Top 0.152: v31.8,32.21 30.96,33.05 29.52,33.05 27.53,35.03 26.31,35.03 IC1.8 | v33.48,35.56 35.15,35.56 v35.53,35.94 | v36.75,33.81 v36.75,35.94 | v43.84,30.3 43.84,29.84 45.9,27.79 v45.9,26.42 | v33.48,17.65 32.33,17.65 31.04,16.36 31.04,14.68 SPI.3
  Bottom 0.152: v31.8,32.21 31.8,37.08 32.11,37.39 32.72,37.39 33.48,36.63 v33.48,35.56 | v36.75,35.94 v35.53,35.94 | v36.75,33.81 39.19,31.37 42.77,31.37 v43.84,30.3 | v45.9,26.42 47.04,25.27 47.04,21.92 42.77,17.65 v33.48,17.65
SDI3  (via drill 0.35)
  Top 0.152: v30.43,24.97 30.58,25.12 30.58,26.26 IC1.32 | v27.46,18.11 27.15,18.11 v26.01,16.97
  Bottom 0.152: v30.43,24.97 28.98,24.97 27.15,23.14 27.15,18.41 v27.46,18.11 | v26.01,16.97 26.01,14.61 26.62,13.99 SPI.1
SDO3  (via drill 0.35)
  Top 0.152: v26.24,22.23 24.33,24.13 24.33,29.16 24.94,29.77 26.24,29.77 IC1.21
  Bottom 0.152: v26.24,22.23 26.24,17.65 27.23,16.66 27.23,15.82 29.06,13.99 29.21,13.99 SPI.2
SPI_EN0  (via drill 0.35)
  Top 0.152: 25.48,35.87 26.24,35.87 IC1.6 24.82,35.82 23.34,37.31 v23.34,40.96 | v36.45,66.19 36.37,66.27 25.09,66.27 17.63,58.8 v17.63,54.3
  Bottom 0.152: v36.45,66.19 43.46,73.2 52.15,73.2 52.45,73.51 61.06,73.51 63.8,70.76 63.8,69.47 68,65.28 68,63.14 71.58,59.56 71.58,50.72 74.85,47.45 74.85,30.76 71.73,27.63 69.22,27.63 57.63,16.05 38.43,16.05 38.12,15.75 36.07,15.75 SPI.4 | v23.34,40.96 23.34,43.5 22.86,43.5 17.62,48.74 17.63,48.74 v17.63,54.3
SPI_EN1  (via drill 0.35)
  Top 0.152: v27.61,35.79 27.3,35.48 26.31,35.48 IC1.7 | v18.24,49.05 18.24,58.95 24.33,65.05 36.3,65.05 43.38,57.96 43.38,46.23 v44.14,45.47 | v47.12,33.2 50.32,30 v55.35,30
  Bottom 0.152: v27.61,35.79 27.61,39.67 v18.24,49.05 | v44.14,45.47 44.14,38 47.12,35.03 v47.12,33.2 | v55.35,30 56.64,30 62.59,24.05 62.59,21.92 57.02,16.36 38.28,16.36 37.97,16.05 34.16,16.05 33.25,15.14 33.25,12.85 33.93,12.17 35.08,12.17 36.83,13.92 SPI.5
U1FS  (via drill 0.35)
  Top 0.152: v53.59,57.58 51.61,59.56 51.61,60.02 U1.44 | v66.02,46.84 65.48,46.84 65.25,46.61 U1.22 | v34.7,27.56 34.24,27.1 34.24,26.34 IC1.41 | v45.14,27.63 v45.14,25.88 | v58.01,34.34 58.01,34.87 57.25,35.64 v56.79,35.64
  Bottom 0.152: v53.59,57.58 55.27,57.58 v66.02,46.84 66.85,46 66.85,43.64 66.09,42.88 57.48,42.88 53.75,39.14 53.75,36.09 54.2,35.64 v56.79,35.64 | v34.7,27.56 43.38,27.56 45.06,25.88 v45.14,25.88 | v45.14,27.63 47.5,27.63 49.1,29.23 49.1,29.84 53.59,34.34 v58.01,34.34
U1O1  (via drill 0.35)
  Top 0.178: U1.9 56.79,46.61 56.19,46.61 U1.8 56.11,46.61 55.5,46.61 U1.7 55.5,46.68 v55.5,48.74
  Bottom 0.178: v55.5,48.74 55.5,54.76 51.23,59.03 51.23,71.83 52.53,73.13 57.86,73.13 59.61,71.37 59.61,70.46 64.41,65.66 65.33,65.66 J1.12
U1O2
  Top 0.178: U1.38 56.11,60.1 U1.37 56.19,60.1 U1.36 56.79,60.17 56.79,62.69 59,64.9 59,66.12 63.96,71.07 65.33,71.07 J1.11
U1O3
  Top 0.178: U1.31 60.07,60.1 60.68,60.1 U1.30 60.76,60.1 61.14,60.1 | 61.14,60.1 61.29,60.1 U1.29 | 61.14,60.1 61.14,65.58 J1.10
U1O4
  Top 0.178: U1.16 61.29,46.61 60.76,46.61 U1.15 60.68,46.61 60.07,46.61 U1.14 60.07,46.68 60.07,47.07 57.71,49.43 51.99,49.43 49.86,51.56 49.86,64.14 51.23,65.51 51.23,66.34 54.36,69.47 59.54,69.47 61.14,71.07 J1.9
U2FS  (via drill 0.35)
  Top 0.152: v77.9,30.76 77.9,28.85 U2.22 | v76.53,39.75 72.19,39.75 v72.03,39.9 | v65.56,40.51 64.34,41.73 64.34,42.27 U2.44 | v34.39,24.97 34.62,25.2 34.62,26.26 IC1.42 | v50.55,25.2 v46.2,25.2 | v57.86,27.41 58.93,28.47 58.93,34.95 v60.76,36.78
  Bottom 0.152: v77.9,30.76 77.9,38.38 v76.53,39.75 | v72.03,39.9 71.43,40.51 v65.56,40.51 64.49,40.51 v60.76,36.78 | v34.39,24.97 36.52,24.97 38.43,26.87 43.16,26.87 44.83,25.2 v46.2,25.2 | v50.55,25.2 55.65,25.2 v57.86,27.41
U2RX  (via drill 0.35)
  Top 0.152: v23.72,24.74 23.72,29.01 24.87,30.15 26.24,30.15 IC1.20 | v23.88,2.87 49.1,2.87 49.33,2.64 v78.82,2.64 | v96.27,38.53 92.08,42.72 IC4.20
  Bottom 0.152: v23.72,24.74 23.72,21.54 23.11,20.93 23.11,3.63 v23.88,2.87 | v78.82,2.64 90.09,13.92 90.55,13.92 96.27,19.63 v96.27,38.53
U2TX  (via drill 0.35)
  Top 0.152: v43.46,12.32 43.46,14.61 35.38,22.68 35.38,26.26 IC1.44 | v68.22,12.09 68.22,14.76 v70.82,17.35 | IC4.1 v92.08,31.52
  Bottom 0.152: v43.46,12.32 43.92,12.32 44.37,11.86 68,11.86 v68.22,12.09 | v70.82,17.35 77.9,17.35 v92.08,31.52
U3RX  (via drill 0.35)
  Top 0.152: v36.91,38.46 36.98,38.53 36.98,39.75 IC1.78 | v39.73,39.22 41.25,39.22 46.2,44.17 46.2,44.4 47.27,45.47 v51,45.47 | v57.94,44.48 58.47,43.94 v58.47,41.81 | v78.89,31.37 v66.09,31.37 | v93.45,34.65 94.59,33.5 94.59,33.12 IC4.3
  Bottom 0.152: v36.91,38.46 38.96,38.46 v39.73,39.22 | v51,45.47 52.07,45.47 52.6,46 56.41,46 v57.94,44.48 | v58.47,41.81 58.47,38.15 62.43,34.19 64.57,34.19 66.09,32.66 v66.09,31.37 | v78.89,31.37 87.12,31.37 90.4,34.65 v93.45,34.65
U3TX  (via drill 0.35)
  Top 0.152: v39.27,41.96 38.81,41.96 37.44,40.59 37.44,39.83 IC1.77 | v42.55,45.24 42.55,49.28 42.77,49.5 42.77,57.2 v42.47,57.51 | v49.25,67.56 49.25,69.47 51.23,71.45 51.23,71.75 53.44,73.97 v70.36,73.97 | v91.62,35.26 93.29,33.58 93.29,33.12 IC4.2
  Bottom 0.152: v42.55,45.24 v39.27,41.96 | v42.47,57.51 48.95,63.98 49.25,63.98 50.24,64.97 50.24,66.57 v49.25,67.56 | v70.36,73.97 71.27,73.97 91.62,53.62 v91.62,35.26
U6RX  (via drill 0.35)
  Top 0.152: v43.38,22.99 37.82,28.55 37.82,33.5 38.89,34.57 39.73,34.57 IC1.67 | v45.82,21.62 48.79,21.62 54.43,15.98 62.74,15.98 v63.12,16.36 | v85.83,20.09 86.97,21.23 86.97,21.39 IC2.7